# EasyEDA schematic zaku_core_v1.json
TITLE: Zaku Core; REV: 1.0; Date: 2023-01-09; Sheet: 1/1; Drawn By: macbury; Company: Arek
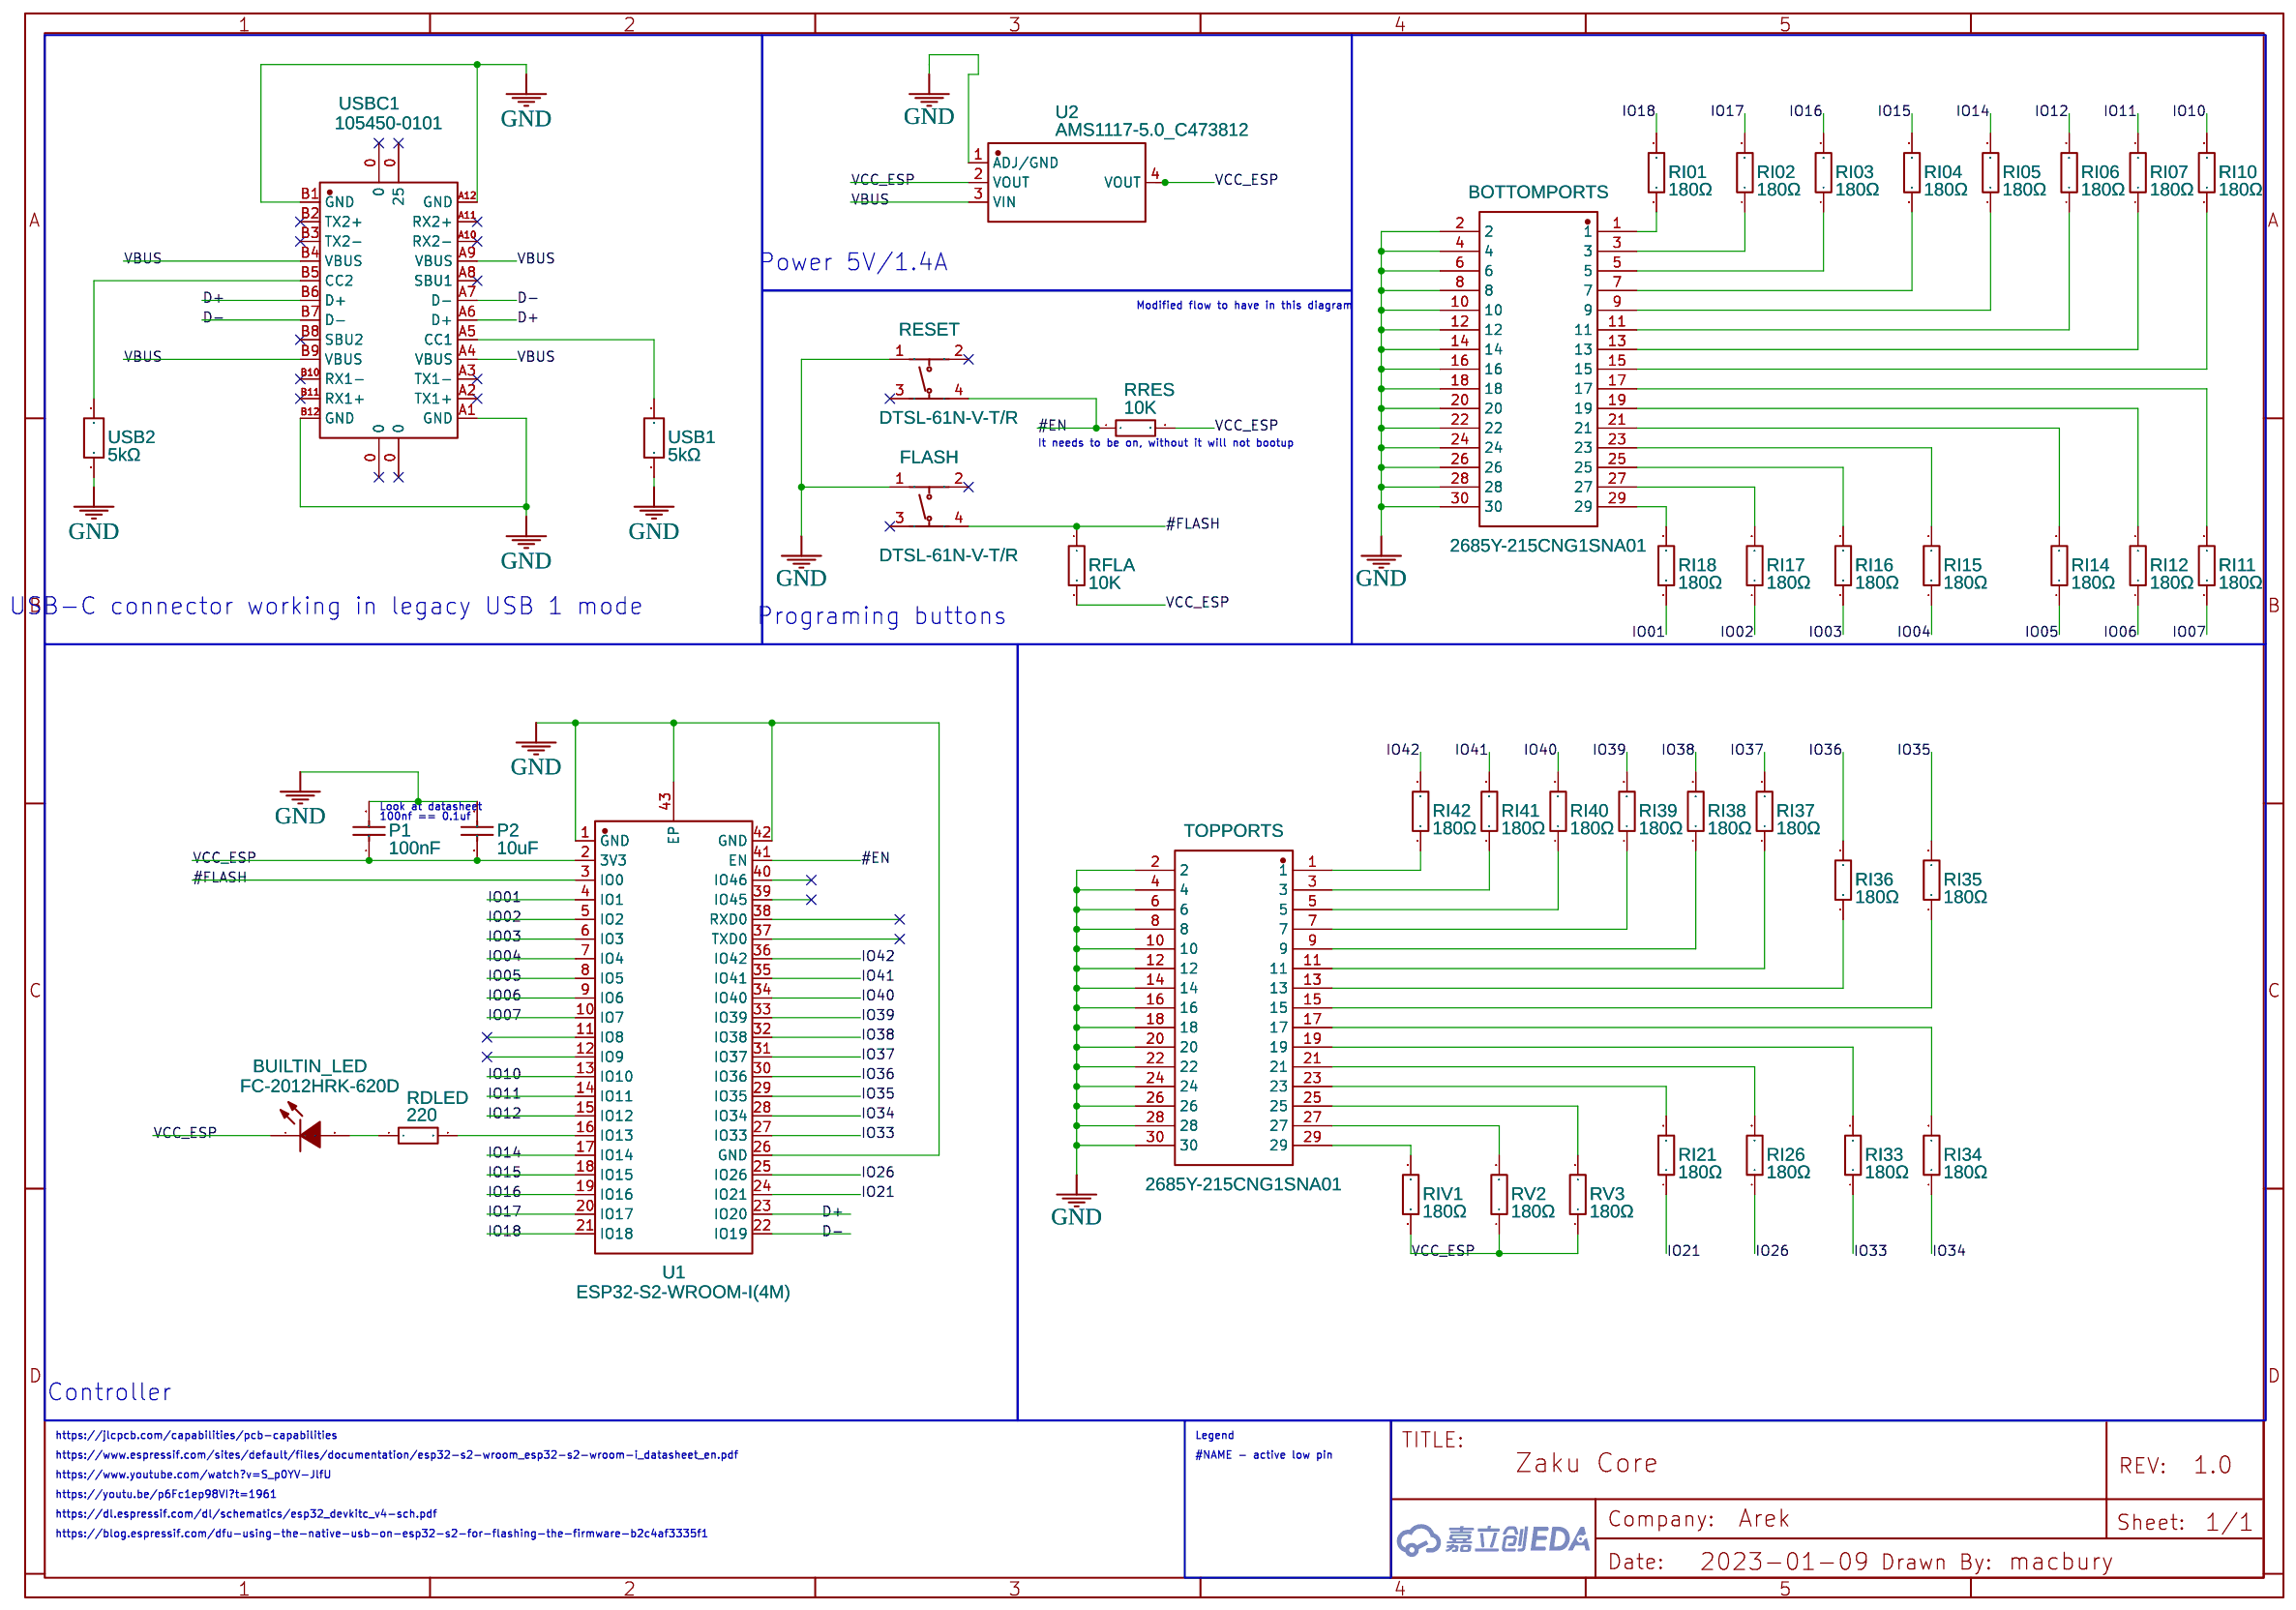
[diagram p0: schematic sheet]

## Parts
BOTTOMPORTS  2685Y-215CNG1SNA01  [HDR-TH_30P-P2.54-V-F-R2-C15-S2.54]
BUILTIN_LED  FC-2012HRK-620D  [LED0805-R-RD]
FLASH  DTSL-61N-V-T/R  [SW-SMD_4P-L6.2-W6.4-P4.00-LS7.2]
P1  100nF  [C0402_NEW]
P2  10uF  [C1206]
RDLED  220  [R0603]
RESET  DTSL-61N-V-T/R  [SW-SMD_4P-L6.2-W6.4-P4.00-LS7.2]
RFLA  10K  [R0402]
RI01  180Ω  [R0603]
RI02  180Ω  [R0603]
RI03  180Ω  [R0603]
RI04  180Ω  [R0603]
RI05  180Ω  [R0603]
RI06  180Ω  [R0603]
RI07  180Ω  [R0603]
RI10  180Ω  [R0603]
RI11  180Ω  [R0603]
RI12  180Ω  [R0603]
RI14  180Ω  [R0603]
RI15  180Ω  [R0603]
RI16  180Ω  [R0603]
RI17  180Ω  [R0603]
RI18  180Ω  [R0603]
RI21  180Ω  [R0603]
RI26  180Ω  [R0603]
RI33  180Ω  [R0603]
RI34  180Ω  [R0603]
RI35  180Ω  [R0603]
RI36  180Ω  [R0603]
RI37  180Ω  [R0603]
RI38  180Ω  [R0603]
RI39  180Ω  [R0603]
RI40  180Ω  [R0603]
RI41  180Ω  [R0603]
RI42  180Ω  [R0603]
RIV1  180Ω  [R0603]
RRES  10K  [R0402]
RV2  180Ω  [R0603]
RV3  180Ω  [R0603]
TOPPORTS  2685Y-215CNG1SNA01  [HDR-TH_30P-P2.54-V-F-R2-C15-S2.54]
U1  ESP32-S2-WROOM-I(4M)  [WIFI-SMD_ESP32-S2-WROVER-I]
U2  AMS1117-5.0_C473812  [SOT-223-3_L6.7-W3.7-P2.30-LS7.0-BR]
USB1  5kΩ  [R0603]
USB2  5kΩ  [R0603]
USBC1  105450-0101  [USB-C-SMD_TYPE-C-USB-18]

## Library data of the parts
BOTTOMPORTS TOPPORTS = 2685Y-215CNG1SNA01: Supplier: LCSC; Supplier Part: C350294; Manufacturer: 华宇创; Contributor: LCSC; JLCPCB Part Class: Extended Part
BUILTIN_LED = FC-2012HRK-620D: Supplier: LCSC; Manufacturer: 国星光电; Manufacturer Part: NCD0805R1; Supplier Part: C84256; JLCPCB Part Class: Basic Part
FLASH RESET = DTSL-61N-V-T/R: Supplier: LCSC; Supplier Part: C495902; Manufacturer: Diptronics; Contributor: LCSC; JLCPCB Part Class: Extended Part
P1 = CL05B104KO5NNNC: Supplier: LCSC; Manufacturer: SAMSUNG(三星); Supplier Part: C1525; JLCPCB Part Class: Basic Part
P2 = CL31A106KBHNNNE: Supplier: LCSC; Manufacturer: SAMSUNG(三星); Supplier Part: C13585; JLCPCB Part Class: Basic Part
RDLED = RC0603FR-07220RL: Supplier: LCSC; Manufacturer: YAGEO(国巨); Supplier Part: C107696; JLCPCB Part Class: Extended Part; Resistance: 220Ω
RFLA RRES = RC0402FR-0710KL: Supplier: LCSC; Manufacturer: YAGEO(国巨); Supplier Part: C60490; JLCPCB Part Class: Extended Part; Resistance: 10kΩ
RI01 RI02 RI03 RI04 RI05 RI06 RI07 RI10-RI12 RI14-RI18 RI21 RI26 RI33-RI42 RIV1 RV2 RV3 = 0603WAF1800T5E: Supplier: LCSC; Manufacturer: UNI-ROYAL(厚声); Supplier Part: C22828; Resistance (Ohms): 180; JLCPCB Part Class: Basic Part
U1 = ESP32-S2-WROOM-I(4M): Supplier: LCSC; Supplier Part: C967026; Manufacturer: ESPRESSIF(乐鑫); Manufacturer Part: ESP32-S2-WROOM-I-N4; Contributor: LCSC; JLCPCB Part Class: Extended Part
U2 = AMS1117-5.0_C473812: Supplier: LCSC; Supplier Part: C473812; Manufacturer: Slkor(萨科微); Manufacturer Part: AMS1117-5.0; Contributor: LCSC; JLCPCB Part Class: Extended Part
USB1 USB2 = AR03BTCX5001: Supplier: LCSC; Supplier Part: C2828621; Manufacturer: Viking(光颉); JLCPCB Part Class: Extended Part; Contributor: LCSC
USBC1 = 105450-0101: Supplier: LCSC; Supplier Part: C134092; Manufacturer: MOLEX; Contributor: LCSC; JLCPCB Part Class: Extended Part

## Nets
GND: BOTTOMPORTS.2 BOTTOMPORTS.4 BOTTOMPORTS.6 BOTTOMPORTS.8 BOTTOMPORTS.10 BOTTOMPORTS.12 BOTTOMPORTS.14 BOTTOMPORTS.16 BOTTOMPORTS.18 BOTTOMPORTS.20 BOTTOMPORTS.22 BOTTOMPORTS.24 BOTTOMPORTS.26 BOTTOMPORTS.28 BOTTOMPORTS.30 FLASH.1 P1.2 P2.2 RESET.1 TOPPORTS.2 TOPPORTS.4 TOPPORTS.6 TOPPORTS.8 TOPPORTS.10 TOPPORTS.12 TOPPORTS.14 TOPPORTS.16 TOPPORTS.18 TOPPORTS.20 TOPPORTS.22 TOPPORTS.24 TOPPORTS.26 TOPPORTS.28 TOPPORTS.30 U1.1(GND) U1.26(GND) U1.42(GND) U1.43(EP) U2.1(ADJ/GND) USB1.1 USB2.1 USBC1.A1(GND) USBC1.A12(GND) USBC1.B1(GND) USBC1.B12(GND)
VBUS: U2.3(VIN) USBC1.A4(VBUS) USBC1.A9(VBUS) USBC1.B4(VBUS) USBC1.B9(VBUS)
VCC_ESP: BUILTIN_LED.1(-) P1.1 P2.1 RFLA.2 RIV1.1 RRES.2 RV2.1 RV3.1 U1.2(3V3) U2.2(VOUT) U2.4(VOUT)
#EN: RESET.4 RRES.1 U1.41(EN)
#FLASH: FLASH.4 RFLA.1 U1.3(IO0)
D+: U1.23(IO20) USBC1.A6(D+) USBC1.B6(D+)
D-: U1.22(IO19) USBC1.A7(D-) USBC1.B7(D-)
IO01: RI18.1 U1.4(IO1)
IO02: RI17.1 U1.5(IO2)
IO03: RI16.1 U1.6(IO3)
IO04: RI15.1 U1.7(IO4)
IO05: RI14.1 U1.8(IO5)
IO06: RI12.1 U1.9(IO6)
IO07: RI11.1 U1.10(IO7)
IO10: RI10.2 U1.13(IO10)
IO11: RI07.2 U1.14(IO11)
IO12: RI06.2 U1.15(IO12)
IO14: RI05.2 U1.17(IO14)
IO15: RI04.2 U1.18(IO15)
IO16: RI03.2 U1.19(IO16)
IO17: RI02.2 U1.20(IO17)
IO18: RI01.2 U1.21(IO18)
IO21: RI21.1 U1.24(IO21)
IO26: RI26.1 U1.25(IO26)
IO33: RI33.1 U1.27(IO33)
IO34: RI34.1 U1.28(IO34)
IO35: RI35.2 U1.29(IO35)
IO36: RI36.2 U1.30(IO36)
IO37: RI37.2 U1.31(IO37)
IO38: RI38.2 U1.32(IO38)
IO39: RI39.2 U1.33(IO39)
IO40: RI40.2 U1.34(IO40)
IO41: RI41.2 U1.35(IO41)
IO42: RI42.2 U1.36(IO42)
Net-(BOTTOMPORTS-1): BOTTOMPORTS.1 RI01.1
Net-(BOTTOMPORTS-3): BOTTOMPORTS.3 RI02.1
Net-(BOTTOMPORTS-5): BOTTOMPORTS.5 RI03.1
Net-(BOTTOMPORTS-7): BOTTOMPORTS.7 RI04.1
Net-(BOTTOMPORTS-9): BOTTOMPORTS.9 RI05.1
Net-(BOTTOMPORTS-11): BOTTOMPORTS.11 RI06.1
Net-(BOTTOMPORTS-13): BOTTOMPORTS.13 RI07.1
Net-(BOTTOMPORTS-15): BOTTOMPORTS.15 RI10.1
Net-(BOTTOMPORTS-17): BOTTOMPORTS.17 RI11.2
Net-(BOTTOMPORTS-19): BOTTOMPORTS.19 RI12.2
Net-(BOTTOMPORTS-21): BOTTOMPORTS.21 RI14.2
Net-(BOTTOMPORTS-23): BOTTOMPORTS.23 RI15.2
Net-(BOTTOMPORTS-25): BOTTOMPORTS.25 RI16.2
Net-(BOTTOMPORTS-27): BOTTOMPORTS.27 RI17.2
Net-(BOTTOMPORTS-29): BOTTOMPORTS.29 RI18.2
Net-(BUILTIN_LED-2): BUILTIN_LED.2(+) RDLED.1
Net-(RDLED-2): RDLED.2 U1.16(IO13)
Net-(RI21-2): RI21.2 TOPPORTS.23
Net-(RI26-2): RI26.2 TOPPORTS.21
Net-(RI33-2): RI33.2 TOPPORTS.19
Net-(RI34-2): RI34.2 TOPPORTS.17
Net-(RI35-1): RI35.1 TOPPORTS.15
Net-(RI36-1): RI36.1 TOPPORTS.13
Net-(RI37-1): RI37.1 TOPPORTS.11
Net-(RI38-1): RI38.1 TOPPORTS.9
Net-(RI39-1): RI39.1 TOPPORTS.7
Net-(RI40-1): RI40.1 TOPPORTS.5
Net-(RI41-1): RI41.1 TOPPORTS.3
Net-(RI42-1): RI42.1 TOPPORTS.1
Net-(RIV1-2): RIV1.2 TOPPORTS.29
Net-(RV2-2): RV2.2 TOPPORTS.27
Net-(RV3-2): RV3.2 TOPPORTS.25
Net-(USB1-2): USB1.2 USBC1.A5(CC1)
Net-(USB2-2): USB2.2 USBC1.B5(CC2)

Not connected (* = marked no-connect by the designer): FLASH 2* 3*; RESET 2* 3*; U1 11(IO8) 12(IO9) 37(TXD0) 38(RXD0) 39(IO45) 40(IO46); USBC1 0* A2(TX1+)* A3(TX1-)* A8(SBU1)* A10(RX2-)* A11(RX2+)* B2(TX2+)* B3(TX2-)* B8(SBU2)* B10(RX1-)* B11(RX1+)*

## Notes on the sheet
- Power 5V/1.4A
- Modified flow to have in this diagram
- It needs to be on, without it will not bootup
- USB-C connector working in legacy USB 1 mode
- Programing buttons
- 100nf == 0.1uf
- Look at datasheet
- Controller
- https://jlcpcb.com/capabilities/pcb-capabilities
- Legend
- https://www.espressif.com/sites/default/files/documentation/esp32-s2-wroom_esp32-s2-wroom-i_datasheet_en.pdf
- #NAME - active low pin
- https://www.youtube.com/watch?v=S_p0YV-JlfU
- https://dl.espressif.com/dl/schematics/esp32_devkitc_v4-sch.pdf
- https://youtu.be/p6Fc1ep98VI?t=1961
- https://blog.espressif.com/dfu-using-the-native-usb-on-esp32-s2-for-flashing-the-firmware-b2c4af3335f1
